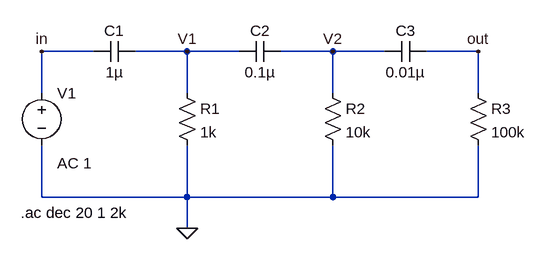
[diagram p0: schematic RC_Highpass Cascaded Filter.asc]
RC_Highpass Cascaded Filter.asc, the LTspice schematic file:
Version 4
SHEET 1 1360 680
WIRE 176 48 96 48
WIRE 320 48 240 48
WIRE 400 48 320 48
WIRE 544 48 464 48
WIRE 624 48 544 48
WIRE 768 48 688 48
WIRE 96 112 96 48
WIRE 320 112 320 48
WIRE 544 112 544 48
WIRE 768 112 768 48
WIRE 96 272 96 192
WIRE 320 272 320 192
WIRE 320 272 96 272
WIRE 544 272 544 192
WIRE 544 272 320 272
WIRE 768 272 768 192
WIRE 768 272 544 272
WIRE 320 320 320 272
FLAG 768 48 out
FLAG 96 48 in
FLAG 320 320 0
FLAG 320 48 V1
FLAG 544 48 V2
SYMBOL voltage 96 96 R0
WINDOW 123 24 124 Left 2
WINDOW 39 0 0 Left 0
SYMATTR Value2 AC 1
SYMATTR InstName V1
SYMATTR Value ""
SYMBOL cap 176 64 R270
WINDOW 0 32 32 VTop 2
WINDOW 3 0 32 VBottom 2
SYMATTR InstName C1
SYMATTR Value 1µ
SYMBOL res 304 96 R0
SYMATTR InstName R1
SYMATTR Value 1k
SYMBOL cap 464 32 R90
WINDOW 0 0 32 VBottom 2
WINDOW 3 32 32 VTop 2
SYMATTR InstName C2
SYMATTR Value 0.1µ
SYMBOL cap 688 32 R90
WINDOW 0 0 32 VBottom 2
WINDOW 3 32 32 VTop 2
SYMATTR InstName C3
SYMATTR Value 0.01µ
SYMBOL res 528 96 R0
SYMATTR InstName R2
SYMATTR Value 10k
SYMBOL res 752 96 R0
SYMATTR InstName R3
SYMATTR Value 100k
TEXT 64 296 Left 2 !.ac dec 20 1 2k

The netlist it stands for:
* RC_Highpass Cascaded Filter.asc
V1 in 0 AC 1
C1 in V1 1µ
R1 V1 0 1k
C2 V2 V1 0.1µ
C3 out V2 0.01µ
R2 V2 0 10k
R3 out 0 100k
.ac dec 20 1 2k
.backanno
.end

* Results of the author's LTspice run, read from the files saved beside the schematic
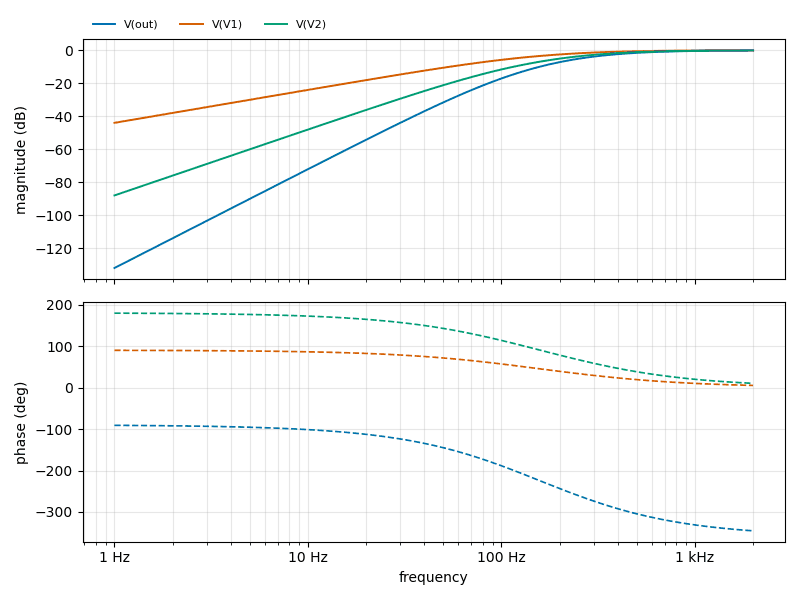
[diagram p1: AC Analysis of RC_Highpass Cascaded Filter.asc, plotted from the saved traces]
* AC Analysis, 1 run:
*   V(out): -132.11 dB at 1 Hz, -0.11 dB at 2 kHz, peak -0.11 dB at 2 kHz, 3 dB below the peak at 340.7 Hz
*   V(V1): -44.04 dB at 1 Hz, -0.04 dB at 2 kHz, peak -0.04 dB at 2 kHz, 3 dB below the peak at 174.7 Hz
*   V(V2): -88.07 dB at 1 Hz, -0.08 dB at 2 kHz, peak -0.08 dB at 2 kHz, 3 dB below the peak at 280 Hz